# Altium schematic sheet PPG.SchDoc
size A4; SheetNumber: 2; SheetTotal: 3; SPICEModelCacheSGABUIPG: <root> / <DocumentId>SGABUIPG</DocumentId> / </root>
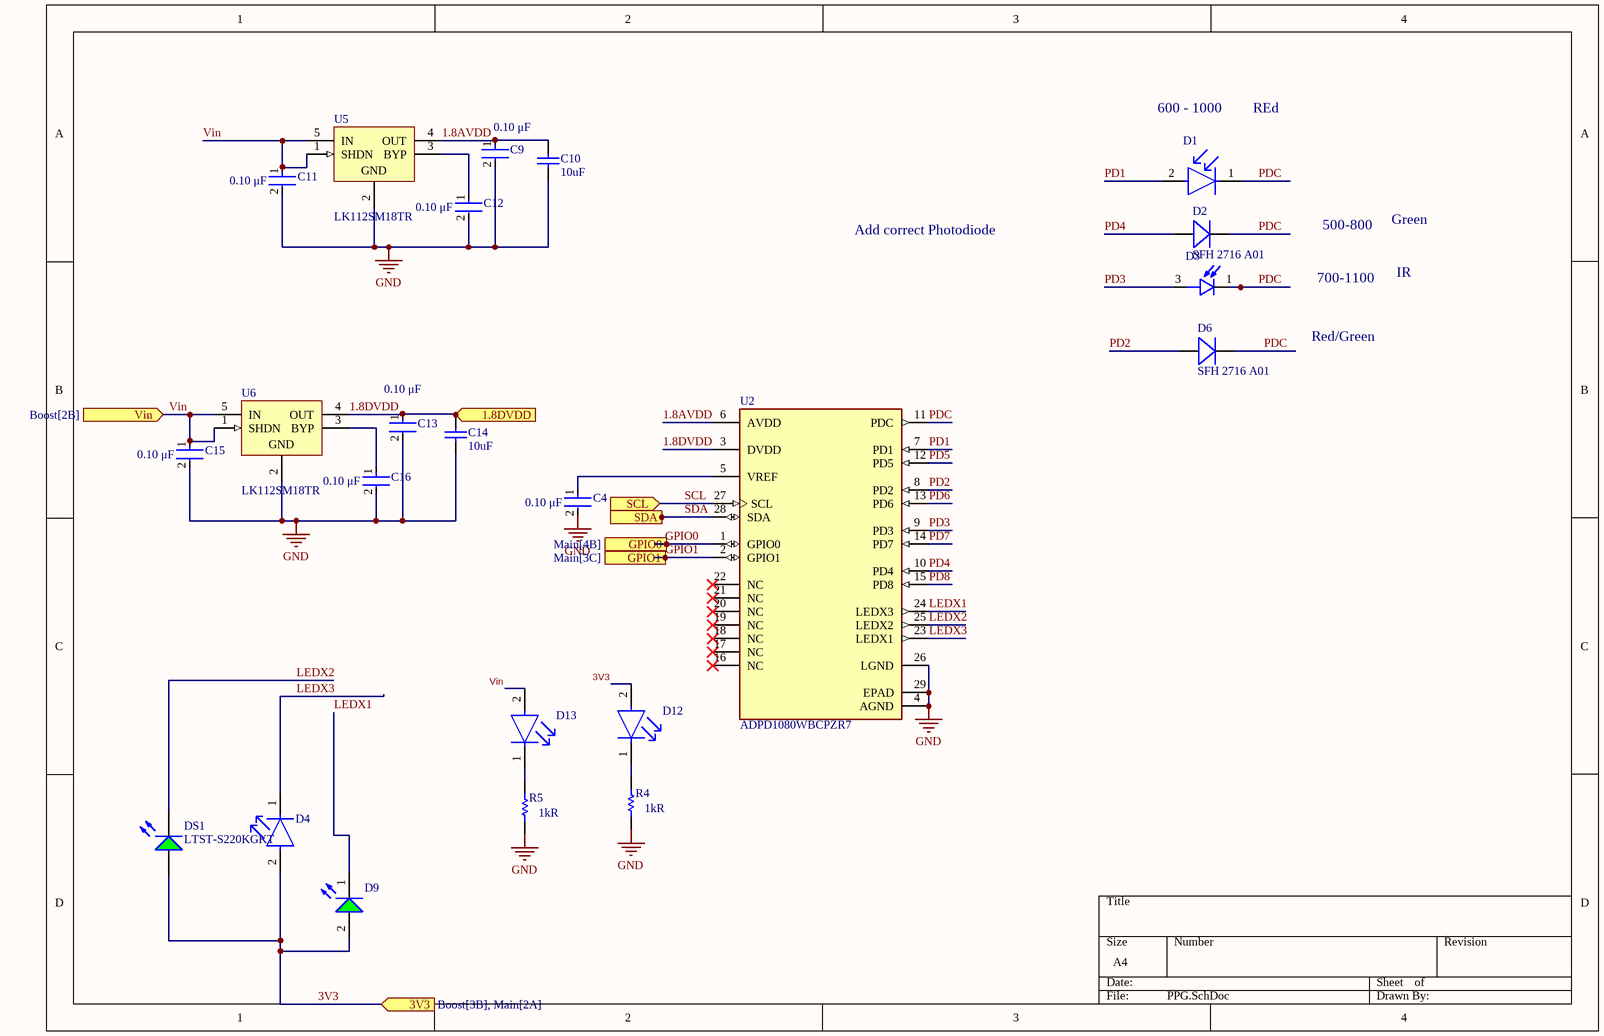
[diagram p0: PPG.SchDoc]

## Parts
C4  Capacitance: 0.10 μF  [FP-C0402-BB-MFG]  (hidden comment: C0402C104K3RACTU)
C9  Capacitance: 0.10 μF  [FP-C0402-BB-MFG]  (hidden comment: C0402C104K3RACTU)
C10  value 10uF  (hidden comment: Capacitor)
C11  Capacitance: 0.10 μF  [FP-C0402-BB-MFG]  (hidden comment: C0402C104K3RACTU)
C12  Capacitance: 0.10 μF  [FP-C0402-BB-MFG]  (hidden comment: C0402C104K3RACTU)
C13  Capacitance: 0.10 μF  [FP-C0402-BB-MFG]  (hidden comment: C0402C104K3RACTU)
C14  value 10uF  (hidden comment: Capacitor)
C15  Capacitance: 0.10 μF  [FP-C0402-BB-MFG]  (hidden comment: C0402C104K3RACTU)
C16  Capacitance: 0.10 μF  [FP-C0402-BB-MFG]  (hidden comment: C0402C104K3RACTU)
D1  SFH 2704  [FP-SFH_2704-MFG]  (value not drawn)
D2  SFH 2716 A01  [SFH 2716 A01]
D3  SFH 2400 FA  [SFH 2400 FA]  (value not drawn)
D4  LS R976-NR-1  [FP-LS_R976-MFG]  (value not drawn)
D6  SFH 2716 A01  [SFH 2716 A01]
D9  150141GS73100  [WL-SMTW_3528]  (value not drawn)
D12  LTST-S270KRKT  [FP-LTST-S270KRKT-MFG]  (value not drawn)
D13  LTST-S270KRKT  [FP-LTST-S270KRKT-MFG]  (value not drawn)
DS1  LTST-S220KGKT  [LTST-S220KGKT_V]
R4  value 1kR  [RESC1005X40X25LL10T10]  (hidden comment: RK73H1ETTP1001F)
R5  value 1kR  [RESC1005X40X25LL10T10]  (hidden comment: RK73H1ETTP1001F)
U2  ADPD1080WBCPZR7  [ADPD1080WBCPZR7]
U5  LK112SM18TR  [SOT23-5L_M]
U6  LK112SM18TR  [SOT23-5L_M]

## Ports
1.8DVDD (in), 3V3 (in, see Boost[3B], Main[2A]), GPIO0 (in, see Main[4B]), GPIO1 (in, see Main[3C]), SCL (in, see Main[3B]), SDA (in, see Main[3B]), Vin (in, see Boost[2B])

## Nets
GND: C4.2 C9.2 C10.1 C11.2 C12.2 C13.2 C14.1 C15.2 C16.2 R4.1 R5.1 U2.4(AGND) U2.26(LGND) U2.29(EPAD) U5.2(GND) U6.2(GND)
1.8AVDD: C9.1 C10.2 U2.6(AVDD) U5.4(OUT)
1.8DVDD: C13.1 C14.2 U2.3(DVDD) U6.4(OUT) ; port 1.8DVDD
3V3: D4.2(A) D9.2(A) D12.2(A) DS1.1(A) ; port 3V3
GPIO0: U2.1(GPIO0) ; port GPIO0
GPIO1: U2.2(GPIO1) ; port GPIO1
LEDX1: D9.1(K) U2.24(LEDX3)
LEDX2: DS1.2(K) U2.25(LEDX2)
LEDX3: D4.1(C) U2.23(LEDX1)
PD1: D1.2(A) U2.7(PD1)
PD2: D6.A U2.8(PD2)
PD3: D3.3(A) U2.9(PD3)
PD4: D2.A U2.10(PD4)
PD5: U2.12(PD5)
PD6: U2.13(PD6)
PD7: U2.14(PD7)
PD8: U2.15(PD8)
PDC: D1.1(C) D2.K D3.1(C) D6.K U2.11(PDC)
SCL: U2.27(SCL) ; port SCL
SDA: U2.28(SDA) ; port SDA
Vin: C11.1 C15.1 D13.2(A) U5.1(SHDN) U5.5(IN) U6.1(SHDN) U6.5(IN) ; port Vin
NetC4_1: C4.1 U2.5(VREF)
NetC12_1: C12.1 U5.3(BYP)
NetC16_1: C16.1 U6.3(BYP)
NetD12_1: D12.1(C) R4.2
NetD13_1: D13.1(C) R5.2

Not connected (* = marked no-connect by the designer): U2 16(NC)* 17(NC)* 18(NC)* 19(NC)* 20(NC)* 21(NC)* 22(NC)*

## Notes on the sheet
- 600 - 1000
- REd
- Add correct Photodiode
- 500-800
- Green
- 700-1100
- IR
- Red/Green

## Library data of the parts
C4 C9 C11-C13 C15 C16 = CMP-03020-012858-1: Cap Ceramic 0.1uF 25V X7R 10% Pad SMD 0402 125C T/R; Manufacturer: Kemet; Value: 0.10 μF; Temperature Coefficient: 15%; Tolerance: 0.1; Dielectric Material: 4241ConductorMaterial; Temperature: -55°C to +125°C; Automotive: No; Height: 0.55mm; Package: C0402-BB; Category: Cap; Temperature Range Low: -55°C; Manufacturer Part Number: C0402C104K3RACTU; Device Class L2: Capacitors; Temperature Characteristic: X7R; Lead Free: Yes; Material: Ceramic; Mouser Description: Cap Ceramic 0.1uF 25V X7R 10% Pad SMD 0402 125C T/R; Temperature Range High: +125°C; Digikey Description: Cap Ceramic 0.1uF 25V X7R 10% Pad SMD 0402 125C T/R; Ipc Land Pattern Name: CAPC10050X50; Voltage Rating: 25 V; ComponentLink2URL: https://content.kemet.com/datasheets/KEM_C1002_X7R_SMD.pdf; Device Class L3: Ceramic Capacitors; RoHS: TRUE; Device Class L1: Passive Components; Octopart: https://octopart.com/c0402c104k3ractu-kemet-71105629; ComponentLink2Description: Datasheet; Supplier: Digikey; Supplier Part Number: 399-14148-1-ND; Stock: 453452; Pricing: 1=0.16, 10=0.095, 100=0.0611, 1000=0.04279, 2500=0.03794, 5000=0.0349 (USD); Case/Package: 0402; Pins: 2NUMBER; Case Code (Metric): 1005; Case Code (Imperial): 0402; Min Operating Temperature: -55°C; Max Operating Temperature: 125°C; Dielectric: X7R; Packaging: Cut Tape; Voltage Rating (DC): 25V; Reach SVHC Compliant: No; RoHS Compliant: Yes; ComponentLink1URL: http://www.farnell.com/datasheets/2746129.pdf?src-supplier=Farnell; ComponentLink1Description: http://www.farnell.com/datasheets/2746129.pdf?src-supplier=Farnell; ComponentLink3URL: http://www.farnell.com/datasheets/2746129.pdf?src-supplier=Newark; ComponentLink3Description: http://www.farnell.com/datasheets/2746129.pdf?src-supplier=Newark; ComponentLink4URL: http://www.farnell.com/datasheets/2746129.pdf?src-supplier=Element14; ComponentLink4Description: http://www.farnell.com/datasheets/2746129.pdf?src-supplier=Element14; ComponentLink5URL: https://datasheet.octopart.com/C0402C104K3RACTU-Kemet-datasheet-62095741.pdf?src-supplier=Element14; ComponentLink5Description: https://datasheet.octopart.com/C0402C104K3RACTU-Kemet-datasheet-62095741.pdf?src-supplier=Element14; ComponentLink6URL: https://api.kemet.com/component-edge/download/datasheet/C0402C104K3RAC7867.pdf?src-supplier=Digikey; ComponentLink6Description: https://api.kemet.com/component-edge/download/datasheet/C0402C104K3RAC7867.pdf?src-supplier=Digikey; ComponentLink7URL: https://datasheet.octopart.com/C0402C104K3RACTU-KEMET-datasheet-176289272.pdf?src-supplier=Newark; ComponentLink7Description: https://datasheet.octopart.com/C0402C104K3RACTU-KEMET-datasheet-176289272.pdf?src-supplier=Newark; ComponentLink8URL: https://datasheet.octopart.com/C0402C104K3RACTU-KEMET-datasheet-157246124.pdf?src-supplier=Electro+Sonic; ComponentLink8Description: https://datasheet.octopart.com/C0402C104K3RACTU-KEMET-datasheet-157246124.pdf?src-supplier=Electro+Sonic
C10 C14 = Capacitor: CL10 Series 0603 10 uF 16 V ±20% Tolerance X5R Multilayer Ceramic Chip Capacitor; Manufacturer: Samsung; Manufacturer Part Number: CL10A106MO8NQNC; SimulationGenericComponent: True; Supplier: Mouser; Supplier Part Number: 187-CL10A106MO8NQNC; RoHS: Yes; Category: Ceramic Capacitors; Stock: 15386; Pricing: 1=0.3, 10=0.167, 50=0.167, 100=0.098, 1000=0.066, 10000=0.047 (USD); Lead Free: 5697LeadFree; ComponentLink1URL: https://datasheet.ciiva.com/25711/cl10a106mo8nqnc-25711536.pdf?src-supplier=Digikey; ComponentLink1Description: https://datasheet.ciiva.com/25711/cl10a106mo8nqnc-25711536.pdf?src-supplier=Digikey; ComponentLink2URL: https://datasheet.ciiva.com/26838/getdatasheetpartid-746571-26838345.pdf?src-supplier=Verical; ComponentLink2Description: https://datasheet.ciiva.com/26838/getdatasheetpartid-746571-26838345.pdf?src-supplier=Verical; ComponentLink3URL: https://datasheet.ciiva.com/29198/457342-da-01-en-vs-kondensator-0603-29198787.pdf?src-supplier=Conrad; ComponentLink3Description: https://datasheet.ciiva.com/29198/457342-da-01-en-vs-kondensator-0603-29198787.pdf?src-supplier=Conrad
D1 = CMP-62027-000006-1: SENSOR PHOTODIODE 900NM 2SMD; Manufacturer: Osram Opto; Viewing Angle: 120°; Dark Current: 100pA; Diode Type: PIN; Response Time: 67ns; Max Reverse Voltage (DC): 6V; RoHS Compliant: Yes; Supplier: Digikey; Supplier Part Number: 475-SFH2704CT-ND; Manufacturer Part Number: SFH 2704; RoHS: Yes; Category: Photodiodes; Stock: 4566; Pricing: 1=0.83, 10=0.576, 100=0.4218, 500=0.35302, 1000=0.33048 (USD); Mounting Technology: Surface Mount; Case/Package: SMD/SMT; Min Operating Temperature: -40°C; Max Operating Temperature: 85°C; Series: CHipLED; Packaging: Cut Tape; Wavelength: 900nm; ComponentLink1URL: https://media.digikey.com/pdf/Data%20Sheets/Osram%20PDFs/SFH_2704_v0.0_9-12-18.pdf?src-supplier=Digikey; ComponentLink1Description: https://media.digikey.com/pdf/Data%20Sheets/Osram%20PDFs/SFH_2704_v0.0_9-12-18.pdf?src-supplier=Digikey; ComponentLink2URL: http://datasheet.octopart.com/SFH-2704-Osram-Opto-datasheet-142374394.pdf?src-supplier=Rs; ComponentLink2Description: http://datasheet.octopart.com/SFH-2704-Osram-Opto-datasheet-142374394.pdf?src-supplier=Rs
D2 D6 = SFH 2716 A01: Silicon PIN Photodiode with Vλ Characteristics, -40 to 100 °C, 1.3 x 2 x 0.8 mm; Manufacturer: Osram Opto; Supplier: DigiKey; Supplier Part Number: 475-SFH2716A01CT-ND; Manufacturer Part Number: SFH 2716 A01; RoHS: Yes; Category: Phototransistor; Stock: 7067; Pricing: 1=1.01, 10=0.615, 100=0.4162, 500=0.33804, 1000=0.31406 (USD); Supplier 1: Digikey; Supplier Part Number 1: 475-SFH2716A01DKR-ND
D4 = CMP-62016-000037-1: LED RED DIFFUSED 0805 SMD; Lens Size: 1.25mm; Number of LEDs: 1; Luminous Intensity: 180mcd; Dominant Wavelength: 633nm; Lens Style: Flat; Reverse Voltage: 12V; Lens Color: White; Forward Voltage: 2.5V; Forward Current: 25mA; Power Dissipation: 65W; Luminous Flux: 0.47lm; Test Current: 20mA; Viewing Angle: 160°; Length: 2mm; Number of Pins: 2; Lens Transparency: Diffused; Min Operating Temperature: -30°C; Case Code (Metric): 2012; Depth: 1.35mm; Color: Red; Illumination Color: Red; Max Operating Temperature: 85°C; Mount: Surface Mount; Case/Package: 0805; Height: 0.9mm; Package Quantity: 16000; Number of Elements: 1; Radiation Hardening: No; Case Code (Imperial): 0805; Packaging: Tape and Reel; Width: 1.25mm
D9 = CMP-1429-00004-2: NexarPartId: 29717794; Manufacturer: Wurth Electronics; Forward Current: 100mA; Lens Style: Clear, Round; Color: Green; Wavelength: 525nm; Peak Wavelength: 515nm; Luminous Intensity: 1cd; Forward Voltage: 3.1V; Viewing Angle: 120°; Test Current: 20mA; Max Reverse Voltage (DC): 5V; Power Dissipation: 105mW; Lens Color: Colorless; Lens Transparency: Clear; Lens Size: 2.4mm; Mount: Surface Mount; Max Operating Temperature: 85°C; Min Operating Temperature: -40°C; Lead Free: Lead Free; Width: 2.8mm; Case Code (Imperial): 1411; REACH SVHC: Unknown; RoHS: Compliant; Packaging: Tape and Reel; Length: 3.5mm; Dominant Wavelength: 525nm; Height: 1.9mm; Case/Package: 3528; Reverse Voltage: 5V; Case Code (Metric): 3528; Supplier: Digikey; Supplier Part Number: 732-4997-1-ND; Manufacturer Part Number: 150141GS73100; Category: LEDs; Stock: 36143; Pricing: 1=0.17, 50=0.1684, 100=0.1467, 500=0.115 (USD); Mounting Technology: Surface Mount; Package Quantity: 1; Series: WL-SMTW; RoHS Compliant: Yes; Reach SVHC Compliant: Unknown; ComponentLink1URL: https://datasheet.ciiva.com/23843/150141gs73100-23843266.pdf?src-supplier=Newark; ComponentLink1Description: https://datasheet.ciiva.com/23843/150141gs73100-23843266.pdf?src-supplier=Newark; ComponentLink2URL: https://datasheet.ciiva.com/29278/759463-da-01-en-smd-topled-einf-gruen-150141gs73100-29278953.pdf?src-supplier=Conrad; ComponentLink2Description: https://datasheet.ciiva.com/29278/759463-da-01-en-smd-topled-einf-gruen-150141gs73100-29278953.pdf?src-supplier=Conrad; ComponentLink3URL: https://datasheet.ciiva.com/22656/1911484-22656997.pdf?src-supplier=Element14; ComponentLink3Description: https://datasheet.ciiva.com/22656/1911484-22656997.pdf?src-supplier=Element14; ComponentLink4URL: https://datasheet.ciiva.com/48430/150141gs73100-eng-tds-48430060.pdf?src-supplier=Distrelec; ComponentLink4Description: https://datasheet.ciiva.com/48430/150141gs73100-eng-tds-48430060.pdf?src-supplier=Distrelec; ComponentLink5URL: https://datasheet.ciiva.com/29563/150141gs73100-29563029.pdf?src-supplier=Digikey; ComponentLink5Description: https://datasheet.ciiva.com/29563/150141gs73100-29563029.pdf?src-supplier=Digikey; ComponentLink6URL: https://datasheet.ciiva.com/29563/150141gs73100-29563030.pdf?src-supplier=Digikey; ComponentLink6Description: https://datasheet.ciiva.com/29563/150141gs73100-29563030.pdf?src-supplier=Digikey
D12 D13 = CMP-2000-06630-2: LED RED CLEAR CHIP SMD R/A; Manufacturer: Vishay Lite-On; Test Current: 20mA; Number of LEDs: 1; Power Rating: 75mW; Lens Style: Diffused; Luminous Intensity: 54mcd; Wavelength: 639nm; Dominant Wavelength: 631nm; Lens Color: Colorless; Forward Voltage: 2V; Viewing Angle: 130°; Forward Current: 30mA; Reverse Voltage: 5V; Lens Size: 0.6mm; Illumination Color: Red; Case Code (Imperial): 0603; Color: Red; Packaging: Tape and Reel; Number of Pins: 2; Length: 1.6mm; Lens Transparency: Clear; Width: 1.15mm; Power Dissipation: 75mW; Lead Free: Lead Free; Max Power Dissipation: 75mW; Case/Package: 0603; Max Operating Temperature: 85°C; Mount: Surface Mount; Depth: 0.6mm; Number of Elements: 1; Radiation Hardening: No; Case Code (Metric): 1608; Package Quantity: 1; Height: 0.6mm; Min Operating Temperature: -55°C; Supplier: Digikey; Supplier Part Number: 160-1479-1-ND; Manufacturer Part Number: LTST-S270KRKT; RoHS: Yes; Category: LEDs; Stock: 83540; Pricing: 1=0.24, 10=0.133, 100=0.0617, 500=0.05696, 1000=0.04462, 2000=0.04367 (USD); Mounting Technology: Surface Mount; Pins: 2; Series: -; RoHS Compliant: Yes; ComponentLink1URL: https://datasheet.ciiva.com/11775/0900766b80dc0b8e-11775445.pdf?src-supplier=Rs; ComponentLink1Description: https://datasheet.ciiva.com/11775/0900766b80dc0b8e-11775445.pdf?src-supplier=Rs; ComponentLink2URL: https://datasheet.ciiva.com/12400/ltst-s270krkt-201849-12400833.pdf?src-supplier=Mouser; ComponentLink2Description: https://datasheet.ciiva.com/12400/ltst-s270krkt-201849-12400833.pdf?src-supplier=Mouser; ComponentLink3URL: https://datasheet.ciiva.com/2110/ltst-s270krkt-2110021.pdf?src-supplier=Digikey; ComponentLink3Description: https://datasheet.ciiva.com/2110/ltst-s270krkt-2110021.pdf?src-supplier=Digikey; ComponentLink4URL: https://datasheet.ciiva.com/16387/p-100-ltst-s270krkt-16387507.pdf?src-supplier=Future+Electronics; ComponentLink4Description: https://datasheet.ciiva.com/16387/p-100-ltst-s270krkt-16387507.pdf?src-supplier=Future+Electronics; ComponentLink5URL: https://datasheet.ciiva.com/2110/s-110-ltst-s270krkt-2110023.pdf?src-supplier=Digikey; ComponentLink5Description: https://datasheet.ciiva.com/2110/s-110-ltst-s270krkt-2110023.pdf?src-supplier=Digikey; ComponentLink6URL: https://datasheet.ciiva.com/2110/s-110-ltst-s270krkt-2110022.pdf?src-supplier=Digikey; ComponentLink6Description: https://datasheet.ciiva.com/2110/s-110-ltst-s270krkt-2110022.pdf?src-supplier=Digikey
DS1 = CMP-2000-06628-1: LED Green, 75 mW, 30 mA, -30 to 85 degC, 2-Pin SMD, RoHS, Tape and Reel; Manufacturer: Lite-On; Chip Material: AlGaInP; Lum Intensity: 35mcd; Rad Hardened: No; Number of  Elements: 1; Forward Current: 30mA; Power Dissipation: 75W; Reverse Voltage: 5V; High Brightness: Yes; Test Current (It): 20mA; Dominant Wave Length: 571nm; Emitting Color: YellowGreen; Product Length (mm): 2.1mm; Peak Wavelength: 574nm; Product Depth (mm): 0.6mm; Type: Uni-Color; Main Category: ChipLED; Shape Type: Rectangular; DELETED: Compliant; Forward Voltage: 2.4V; Viewing Angle: 130deg; Product Height (mm): 1mm; Package Reference: S220KGKT; Operating Temp Range: -55Cto85C; Lens Dimensions: 1.7x0.6x0.5mm; Manufacturer URL: http://www.us.liteon.com/; Luminous Intensity: 35mcd; Datasheet URL: http://optoelectronics.liteon.com/upload/download/DS22-2000-075/S_110_LTST-S220KGKT.pdf; Package Type: ChipLed; Packaging: TapeandReel; Mounting Technology: SurfaceMount; Mounting: SurfaceMount; Operating Temperature Classification: Industrial; Package Description: 2-Pin Surface Mount Device, Body 2.15 x 0.6 mm; Datasheet Version: Rev. D, 12/2013; Pin Count: 2
R4 R5 = CMP-2002-03808-1: Manufacturer: KOA Speer; Tolerance: 1%; Power Rating: 63mW; Voltage Rating: 50V; Temperature Coefficient: 100ppm/°C; Max Power Dissipation: 100mW; Part Number: RK73H1ETTP1001F; Supplier: Digikey; Supplier Part Number: 2019-RK73H1ETTP1001FCT-ND; Manufacturer Part Number: RK73H1ETTP1001F; RoHS: Yes; Category: Chip SMD Resistors; Stock: 1021606; Pricing: 1=0.1, 10=0.021, 50=0.0134, 100=0.0112, 500=0.00764, 1000=0.00658, 5000=0.00478 (USD); Mounting Technology: Surface Mount; Case/Package: 0402; Case Code (Imperial): 0402; Case Code (Metric): 1005; Min Operating Temperature: -55°C; Max Operating Temperature: 155°C; Packaging: Tape and Reel; Package Quantity: 10000; Termination: SMD/SMT; Series: RK73H; Construction: Rectangular; Technology: THICK FILM; Features: Moisture Resistant,Automotive AEC-Q200; Number of Terminations: 2; Voltage Rating (DC): 50V; Length: 1mm; Width: 0.5mm; Height: 0.35mm; Depth: 0.5mm; Ratings: AEC-Q200; Military Standard: Not; RoHS Compliant: Yes; Lead Free: 5697LeadFree; ComponentLink1URL: https://datasheet.ciiva.com/5554/rk73h-5554172.pdf?src-supplier=Mouser; ComponentLink1Description: https://datasheet.ciiva.com/5554/rk73h-5554172.pdf?src-supplier=Mouser
U2 = ADPD1080WBCPZR7: Optical Afe For Health Monitorin; Supplier 1: Digikey; Supplier Part Number 1: 505-ADPD1080WBCPZR7CT-ND
U5 U6 = CMP-0244-00332-1: 200mA, Low Noise Low Drop Voltage Regulator with Shutdown Function, 1.8V, 5-Pin SOT23-5L, Tape and Reel; Manufacturer: STMicroelectronics; ComponentLink1Description: Manufacturer URL; ComponentLink1URL: http://www.st.com; ComponentLink2Description: Datasheet; PackageReference: SOT23-5L; DatasheetVersion: 10/07/2008; PackageDescription: 5-Pin SOT-23 Package, 2.9 x 1.6 mm Body, 0.95 mm Pitch, 2.8 mm Lead Span; PackageVersion: 1/01/2008; ComponentLink2URL: http://www.st.com/internet/com/TECHNICAL_RESOURCES/TECHNICAL_LITERATURE/DATASHEET/CD00002558.pdf; Supplier: Digikey; Supplier Part Number: 497-7811-1-ND; Manufacturer Part Number: LK112SM18TR; RoHS: Yes; Category: Voltage Regulators - Linear; Stock: 1322; Pricing: 1=0.91, 10=0.653, 25=0.588, 100=0.5172, 250=0.4834, 500=0.46302, 1000=0.44623 (USD); ComponentLink3URL: https://datasheet.ciiva.com/3225/cd00002558-3225210.pdf?src-supplier=Avnet; ComponentLink3Description: https://datasheet.ciiva.com/3225/cd00002558-3225210.pdf?src-supplier=Avnet; ComponentLink4URL: https://datasheet.ciiva.com/2042/cd00002558-2042967.pdf?src-supplier=Digikey; ComponentLink4Description: https://datasheet.ciiva.com/2042/cd00002558-2042967.pdf?src-supplier=Digikey; ComponentLink5URL: https://datasheet.ciiva.com/2042/cd00002558-2042968.pdf?src-supplier=Digikey; ComponentLink5Description: https://datasheet.ciiva.com/2042/cd00002558-2042968.pdf?src-supplier=Digikey; ComponentLink6URL: https://datasheet.ciiva.com/2042/cd00002558-2042969.pdf?src-supplier=Digikey; ComponentLink6Description: https://datasheet.ciiva.com/2042/cd00002558-2042969.pdf?src-supplier=Digikey